# Altium schematic sheet 04_LMS7002M_Misc.SchDoc: LMS7002M misc
size A3; Organization: Lime Microsystems; Address1: Surrey Tech Centre; Address2: Guildford GU2 7YG; Address3: Surrey; Address4: United Kingdom; Revision: v1.2; SheetNumber: 4; SheetTotal: 16
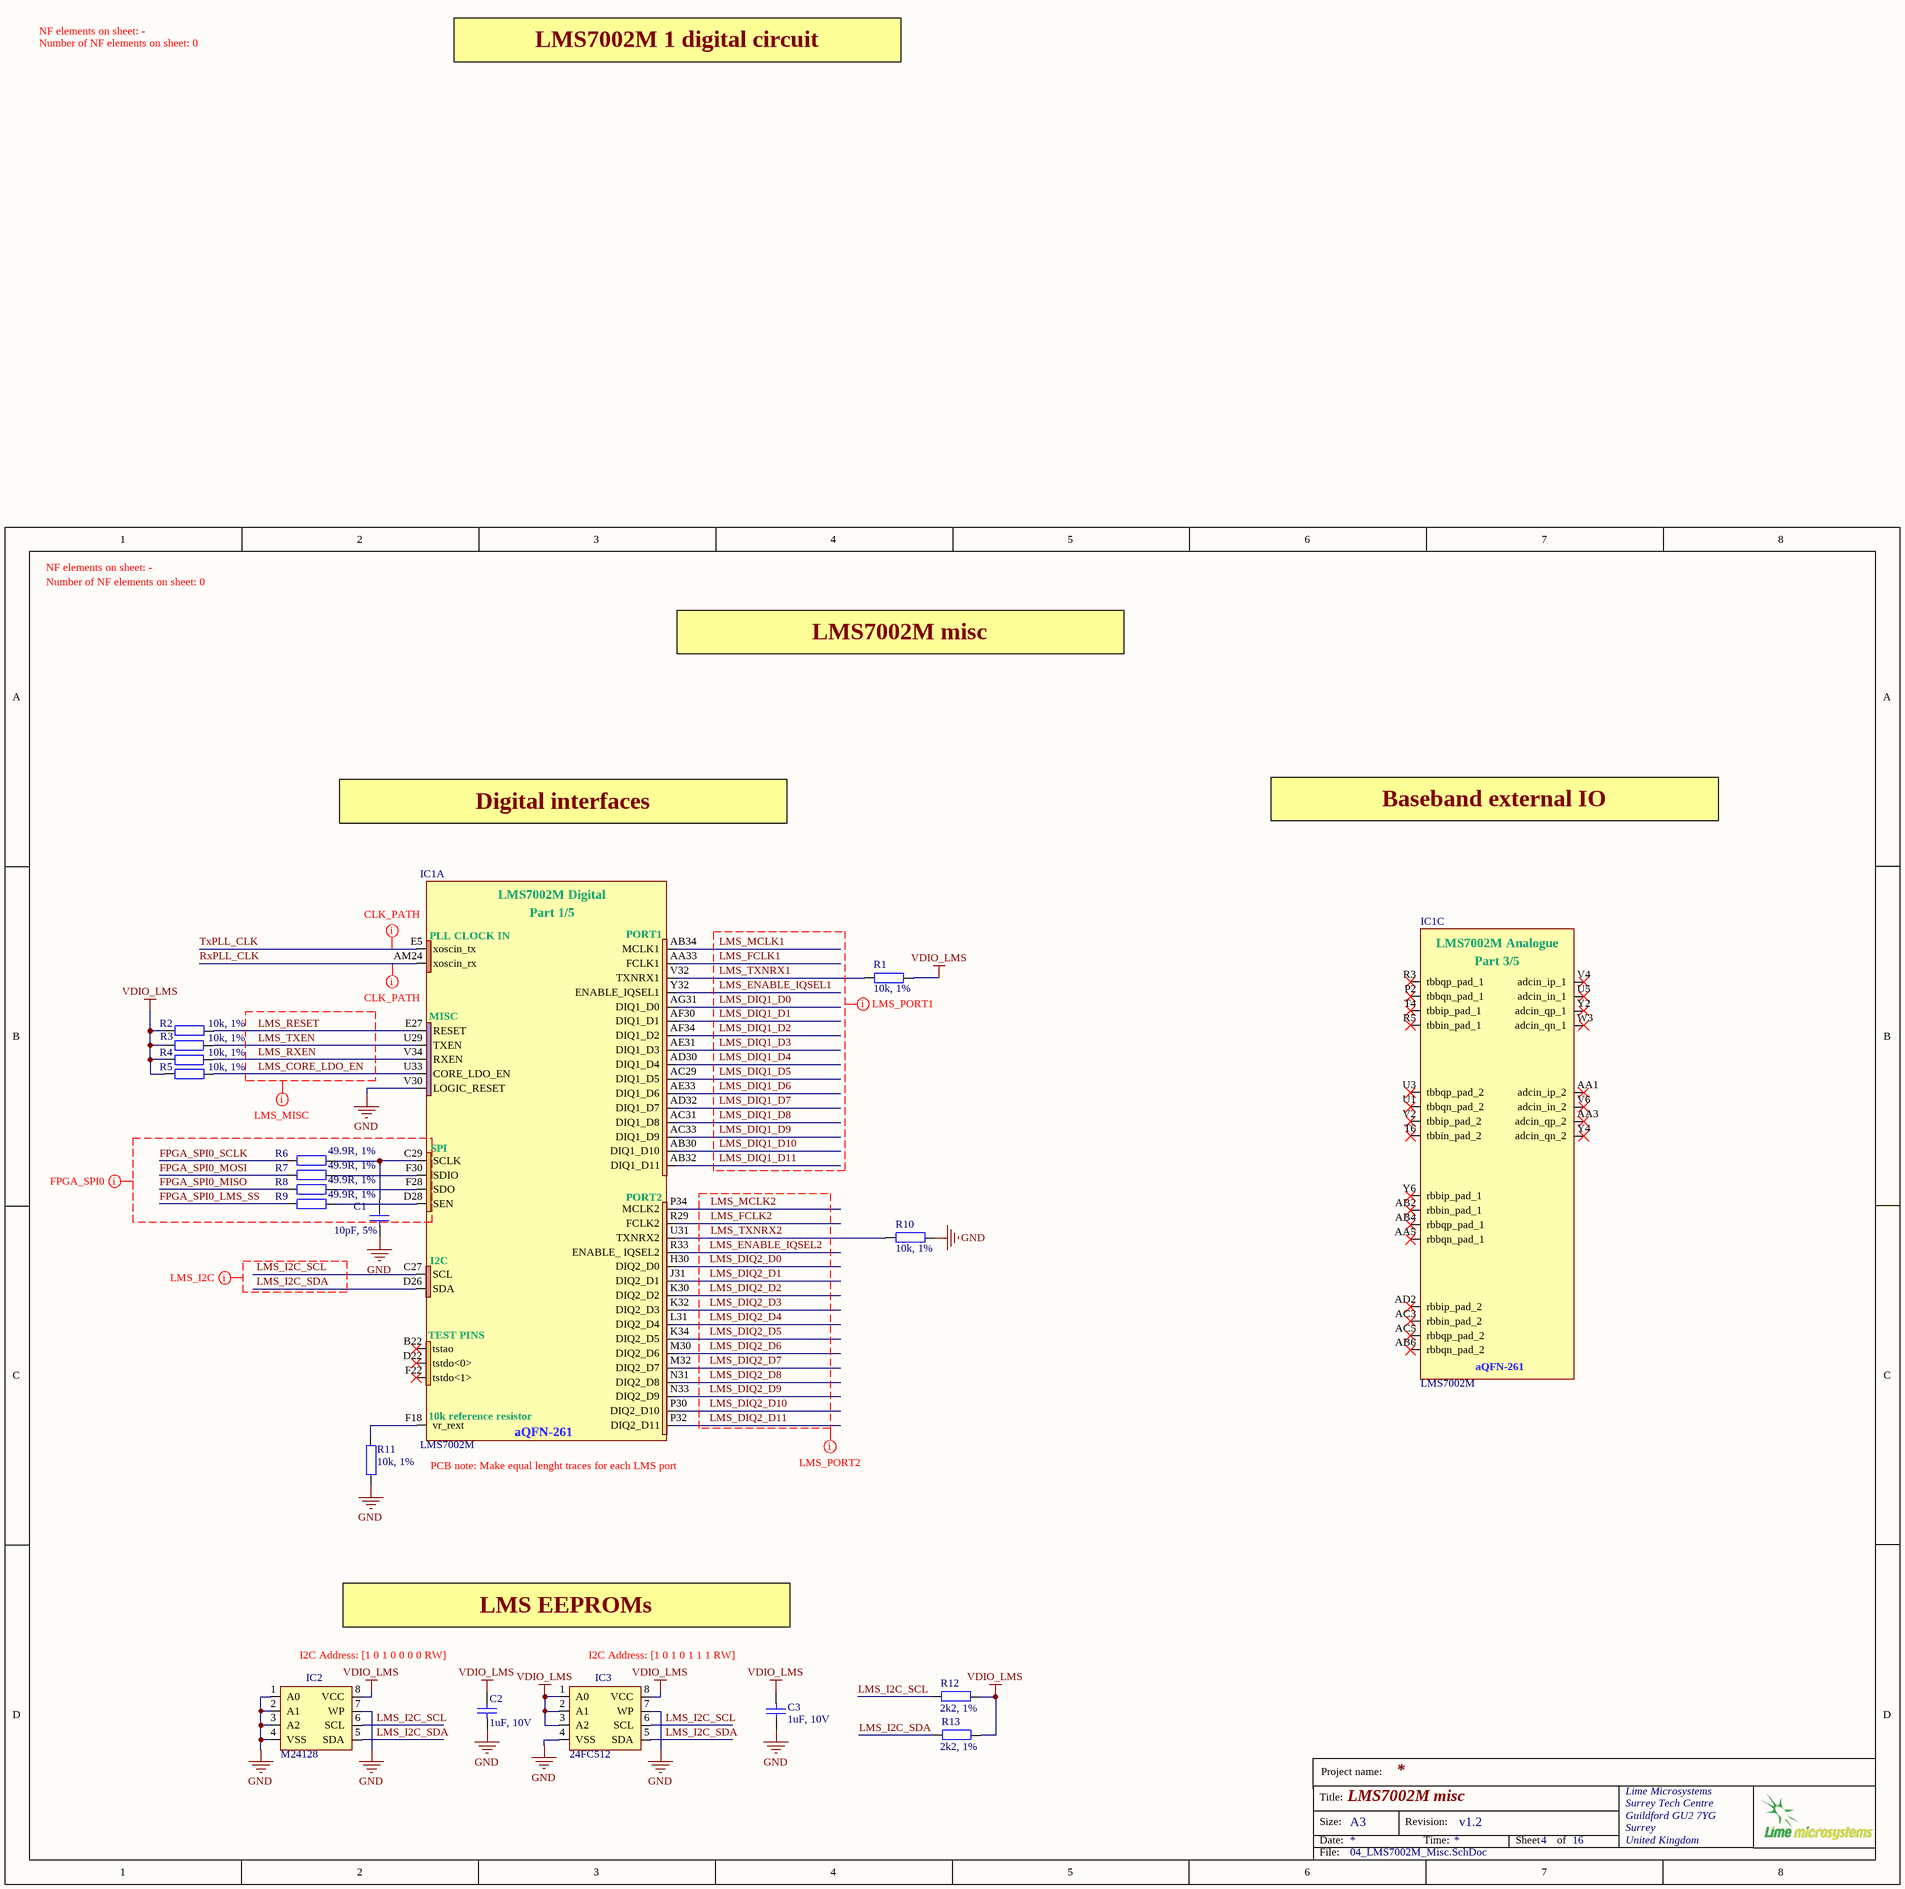
[diagram p0: 04_LMS7002M_Misc.SchDoc]

## Parts
C1  10pF, 5%  [CAP0402]
C2  1uF, 10V  [CAP0402]
C3  1uF, 10V  [CAP0402]
IC1  LMS7002M  [LMS7002M_v2]  (parts A,C of 5)
IC2  M24128  [24FC512]
IC3  24FC512  [24FC512]
R1  10k, 1%  [RES0402]
R2  10k, 1%  [RES0402]
R3  10k, 1%  [RES0402]
R4  10k, 1%  [RES0402]
R5  10k, 1%  [RES0402]
R6  49.9R, 1%  [RES0402]
R7  49.9R, 1%  [RES0402]
R8  49.9R, 1%  [RES0402]
R9  49.9R, 1%  [RES0402]
R10  10k, 1%  [RES0402]
R11  10k, 1%  [RES0402]
R12  2k2, 1%  [RES0402]
R13  2k2, 1%  [RES0402]

## Nets
GND: C1.2 C2.2 C3.1 IC1.V30(LOGIC_RESET) IC2.1(A0) IC2.2(A1) IC2.3(A2) IC2.4(VSS) IC2.7(WP) IC3.4(VSS) IC3.7(WP) R10.1 R11.2
VDIO_LMS: C2.1 C3.2 IC2.8(VCC) IC3.1(A0) IC3.2(A1) IC3.3(A2) IC3.8(VCC) R1.2 R2.2 R3.1 R4.1 R5.2 R12.1 R13.1
FPGA_SPI0_LMS_SS: R9.2
FPGA_SPI0_MISO: R8.2
FPGA_SPI0_MOSI: R7.2
FPGA_SPI0_SCLK: R6.2
LMS_CORE_LDO_EN: IC1.U33(CORE_LDO_EN) R5.1
LMS_DIQ1_D0: IC1.AG31(DIQ1_D0)
LMS_DIQ1_D1: IC1.AF30(DIQ1_D1)
LMS_DIQ1_D2: IC1.AF34(DIQ1_D2)
LMS_DIQ1_D3: IC1.AE31(DIQ1_D3)
LMS_DIQ1_D4: IC1.AD30(DIQ1_D4)
LMS_DIQ1_D5: IC1.AC29(DIQ1_D5)
LMS_DIQ1_D6: IC1.AE33(DIQ1_D6)
LMS_DIQ1_D7: IC1.AD32(DIQ1_D7)
LMS_DIQ1_D8: IC1.AC31(DIQ1_D8)
LMS_DIQ1_D9: IC1.AC33(DIQ1_D9)
LMS_DIQ1_D10: IC1.AB30(DIQ1_D10)
LMS_DIQ1_D11: IC1.AB32(DIQ1_D11)
LMS_DIQ2_D0: IC1.H30(DIQ2_D0)
LMS_DIQ2_D1: IC1.J31(DIQ2_D1)
LMS_DIQ2_D2: IC1.K30(DIQ2_D2)
LMS_DIQ2_D3: IC1.K32(DIQ2_D3)
LMS_DIQ2_D4: IC1.L31(DIQ2_D4)
LMS_DIQ2_D5: IC1.K34(DIQ2_D5)
LMS_DIQ2_D6: IC1.M30(DIQ2_D6)
LMS_DIQ2_D7: IC1.M32(DIQ2_D7)
LMS_DIQ2_D8: IC1.N31(DIQ2_D8)
LMS_DIQ2_D9: IC1.N33(DIQ2_D9)
LMS_DIQ2_D10: IC1.P30(DIQ2_D10)
LMS_DIQ2_D11: IC1.P32(DIQ2_D11)
LMS_ENABLE_IQSEL1: IC1.Y32(ENABLE_IQSEL1)
LMS_ENABLE_IQSEL2: IC1.R33(ENABLE__IQSEL2)
LMS_FCLK1: IC1.AA33(FCLK1)
LMS_FCLK2: IC1.R29(FCLK2)
LMS_I2C_SCL: IC1.C27(SCL) IC2.6(SCL) IC3.6(SCL) R12.2
LMS_I2C_SDA: IC1.D26(SDA) IC2.5(SDA) IC3.5(SDA) R13.2
LMS_MCLK1: IC1.AB34(MCLK1)
LMS_MCLK2: IC1.P34(MCLK2)
LMS_RESET: IC1.E27(RESET) R2.1
LMS_RXEN: IC1.V34(RXEN) R4.2
LMS_TXEN: IC1.U29(TXEN) R3.2
LMS_TXNRX1: IC1.V32(TXNRX1) R1.1
LMS_TXNRX2: IC1.U31(TXNRX2) R10.2
RxPLL_CLK: IC1.AM24(xoscin_rx)
TxPLL_CLK: IC1.E5(xoscin_tx)
NetC1_1: C1.1 IC1.C29(SCLK) R6.1
NetIC1_D28: IC1.D28(SEN) R9.1
NetIC1_F18: IC1.F18(vr_rext) R11.1
NetIC1_F28: IC1.F28(SDO) R8.1
NetIC1_F30: IC1.F30(SDIO) R7.1

Not connected (* = marked no-connect by the designer): IC1 AA1(adcin_ip_2)* AA3(adcin_qp_2)* AA5(rbbqn_pad_1)* AB2(rbbin_pad_1)* AB4(rbbqp_pad_1)* AB6(rbbqn_pad_2)* AC3(rbbin_pad_2)* AC5(rbbqp_pad_2)* AD2(rbbip_pad_2)* B22(tstao)* D22(tstdo<0>)* F22(tstdo<1>)* P2(tbbqn_pad_1)* R3(tbbqp_pad_1)* R5(tbbin_pad_1)* T4(tbbip_pad_1)* T6(tbbin_pad_2)* U1(tbbqn_pad_2)* U3(tbbqp_pad_2)* U5(adcin_in_1)* V2(tbbip_pad_2)* V4(adcin_ip_1)* V6(adcin_in_2)* W3(adcin_qn_1)* Y2(adcin_qp_1)* Y4(adcin_qn_2)* Y6(rbbip_pad_1)*

## Layout directives
net class CLK_PATH: RxPLL_CLK, TxPLL_CLK
net class FPGA_SPI0: FPGA_SPI0_LMS_SS, FPGA_SPI0_MISO, FPGA_SPI0_MOSI, FPGA_SPI0_SCLK
net class LMS_I2C: LMS_I2C_SCL, LMS_I2C_SDA
net class LMS_PORT2: LMS_DIQ2_D0, LMS_DIQ2_D1, LMS_DIQ2_D2, LMS_DIQ2_D3, LMS_DIQ2_D4, LMS_DIQ2_D5, LMS_DIQ2_D6, LMS_DIQ2_D7, LMS_DIQ2_D8, LMS_DIQ2_D9, LMS_DIQ2_D10, LMS_DIQ2_D11, LMS_ENABLE_IQSEL2, LMS_FCLK2, LMS_MCLK2, LMS_TXNRX2
net class LMS_PORT1: LMS_DIQ1_D0, LMS_DIQ1_D1, LMS_DIQ1_D2, LMS_DIQ1_D3, LMS_DIQ1_D4, LMS_DIQ1_D5, LMS_DIQ1_D6, LMS_DIQ1_D7, LMS_DIQ1_D8, LMS_DIQ1_D9, LMS_DIQ1_D10, LMS_DIQ1_D11, LMS_ENABLE_IQSEL1, LMS_FCLK1, LMS_MCLK1, LMS_TXNRX1
net class LMS_MISC: LMS_CORE_LDO_EN, LMS_RESET, LMS_RXEN, LMS_TXEN

## Notes on the sheet
- NF elements on sheet: -
- Number of NF elements on sheet: 0
- LMS7002M 1 digital circuit
- LMS7002M misc
- Digital interfaces
- Baseband external IO
- (near IC1) PCB note: Make equal lenght traces for each LMS port
- I2C Address: [1 0 1 0 0 0 0 RW]
- LMS EEPROMs
- I2C Address: [1 0 1 0 1 1 1 RW]
- Project name:
- Title:
- Size:
- Date:
- A3
- Revision:
- Time:
- Sheet
- of
- File:
- (in symbol LMS7002M, part A) LMS7002M Digital; Part 1/5; PLL CLOCK IN; PORT1; MISC; SPI; PORT2; I2C; TEST PINS; 10k reference resistor; aQFN-261
- (in symbol LMS7002M, part C) LMS7002M Analogue; Part 3/5; aQFN-261

## Library data of the parts
C1 = Cap_0402: Manufacturer Part Number 1: 04023A100JAT2A; Manufacturer: AVX; Part Description: 10pF ±5% 25V C0G, NP0 Ceramic Capacitor -55°C ~ 125°C Surface Mount, MLCC 0402 (1005 Metric) 0.039" L x 0.020" W (1.00mm x 0.50mm); Voltage Rating: 25; Ceramic Capacitor Case: 0402 [1005 Metric]; Capacitor Case Style: 0402 [1005 Metric]<!--FANDB--><div class="features-and-benefits-container"></div>; Dielectric Characteristic: C0G / NP0; SVHC: No SVHC (16-Jun-2014); Capacitance: 10; Value: 10pF, 5%; Supplier 1: Farnell; Supplier Part Number 1: 2332478RL; Capacitance Tolerance: ± 5%; Product Range: -; RoHS: YES; Operating Temperature Min: -55; Operating Temperature Max: 125; Capacitance Tolerance ±: ± 5%; MSL: MSL 1 - Unlimited; Packaging: Cut Tape
C2 C3 = Cap_0402: Manufacturer Part Number 1: GRM155R61A105KE15J; Manufacturer: TDK; Part Description: 1µF ±10% 10V X5R Ceramic Capacitor -55°C ~ 85°C Surface Mount, MLCC 0402 (1005 Metric) 0.039" L x 0.020" W (1.00mm x 0.50mm); Voltage Rating: 10; Capacitance Tolerance: ± 10%; Product Range: TDK - C Series; Ceramic Capacitor Case: 0402 [1005 Metric]; Capacitance: 1; Dielectric Characteristic: X6; Value: 1uF, 10V; Supplier 1: Newark; Supplier Part Number 1: 490-6298-2-ND; MSL: -; RoHS: YES
IC1 = LMS7002M: Manufacturer: Lime Microsystems; Part Description: IC FPRF Transceiver LMS7002M; 261 pin aQFN; Manufacturer Part Number 1: LMS7002M; Supplier 1: Lime Microsystems; Supplier Part Number 1: LMS7002M
IC2 = 24FC64F: Part Description: IC EEPROM 128KBIT 1MHZ 8TSSOP; Manufacturer: STMicroelectronics; Manufacturer Part Number 1: M24128-DRDW8TP/K; Format - Memory: EEPROMs - Serial; Memory Type: EEPROM; Memory Size: 128K (16K x 8); Speed: 1MHz; Interface: I²C, 2-Wire Serial; Voltage - Supply: 1.8 V ~ 5.5 V; Supplier 1: Digi-Key; Supplier Part Number 1: 497-15336-1-ND; RoHS: RoHS Compliant; Category: Integrated Circuits (ICs); Stock 1: 1677; Pricing 1: 1=0.47, 10=0.464, 100=0.3805, 500=0.36996, 1000=0.36005 (USD); Packaging: Cut Tape (CT); Part Status: Active; Operating Temperature: -40°C ~ 105°C (TA); Package / Case: 8-TSSOP (0.173", 4.40mm Width); Supplier Device Package: 8-TSSOP; ComponentLink1URL: http://www.st.com/content/ccc/resource/technical/document/datasheet/5c/f3/4b/70/8e/63/48/95/DM00149696.pdf/files/DM00149696.pdf/jcr:content/translations/en.DM00149696.pdf; ComponentLink1Description: http://www.st.com/content/ccc/resource/technical/document/datasheet/5c/f3/4b/70/8e/63/48/95/DM00149696.pdf/files/DM00149696.pdf/jcr:content/translations/en.DM00149696.pdf
IC3 = 24FC512: Manufacturer Part Number 1: 24FC512-I/ST; Manufacturer: Microchip Technology; Part Description: IC EEPROM 512KBIT 1MHZ 8TSSOP; Speed: 400kHz, 1MHz; Memory Type: EEPROM; Memory Size: 512K (64K x 8); Voltage - Supply: 1.7 V ~ 5.5 V; Interface: I²C, 2-Wire Serial; Format - Memory: EEPROMs - Serial; Supplier 1: Digi-Key; RoHS: RoHS Compliant; Packaging: Tube; Operating Temperature: -40°C ~ 85°C; Supplier Device Package: 8-TSSOP; Category: Integrated Circuits (ICs); Package / Case: 8-TSSOP (0.173", 4.40mm Width); Supplier Part Number 1: 24FC512-I/ST-ND
R1-R5 R10 R11 = Res_0402: Manufacturer: Yageo; Manufacturer Part Number 1: RC0402FR-0710KL; Part Description: RES SMD 10K OHM 1% 1/16W 0402; Temperature Coefficient: ±100ppm/°C; Power (Watts): 0.063W, 1/16W; Value: 10k, 1%; Supplier 1: Digi-Key; Supplier Part Number 1: 311-10.0KLRTR-ND; Resistance (Ohms): 10k; Packaging: Tape & Reel (TR); RoHS: RoHS Compliant; Package / Case: 0402 (1005 Metric); Tolerance: ±1%; Operating Temperature: -55°C ~ 155°C; Size / Dimension: 0.039" L x 0.020" W (1.00mm x 0.50mm); Number of Terminations: 2; Category: Resistors; Height: 0.016" (0.40mm); Supplier Device Package: 0402; Features: Moisture Resistant; Composition: Thick Film
R6-R9 = Res_0402: Manufacturer: Samsung Electro-Mechanics America, Inc.; Manufacturer Part Number: RC1005F49R9CS; Part Description: RES SMD 49.9 OHM 1% 1/16W 0402; Temperature Coefficient: ±100ppm/°C; Resistance (Ohms): 49.9; Power (Watts): 0.063W, 1/16W; Number of Terminations: 2; Size / Dimension: 0.039" L x 0.020" W (1.00mm x 0.50mm); Supplier Device Package: 0402 (1005 Metric); RoHS: RoHS Compliant; Supplier Part Number 1: 1276-3469-6-ND; Features: -; Packaging: Digi-Reel®; Tolerance: ±1%; Height: 0.016" (0.40mm); Category: Resistors; Composition: Thick Film; Package / Case: 0402 (1005 Metric); Supplier 1: Digi-Key; Operating Temperature: -55°C ~ 155°C; Value: 49.9R, 1%
R12 R13 = Res_0402: Manufacturer: Stackpole Electronics Inc; Manufacturer Part Number 1: RMCF0402FT2K20; Part Description: RES SMD 2.2K OHM 1% 1/16W 0402; Resistance (Ohms): 2.2k; Temperature Coefficient: ±100ppm/°C; Power (Watts): 0.063W, 1/16W; Value: 2k2, 1%; Supplier 1: Digi-Key; Supplier Part Number 1: RMCF0402FT2K20CT-ND; Supplier Device Package: 0402; Package / Case: 0402 (1005 Metric); Size / Dimension: 0.039" L x 0.020" W (1.00mm x 0.50mm); Operating Temperature: -55°C ~ 155°C; Composition: Thick Film; Category: Resistors; Features: -; Height: 0.016" (0.40mm); RoHS: RoHS Compliant; Number of Terminations: 2; Packaging: Cut Tape (CT); Tolerance: ±1%